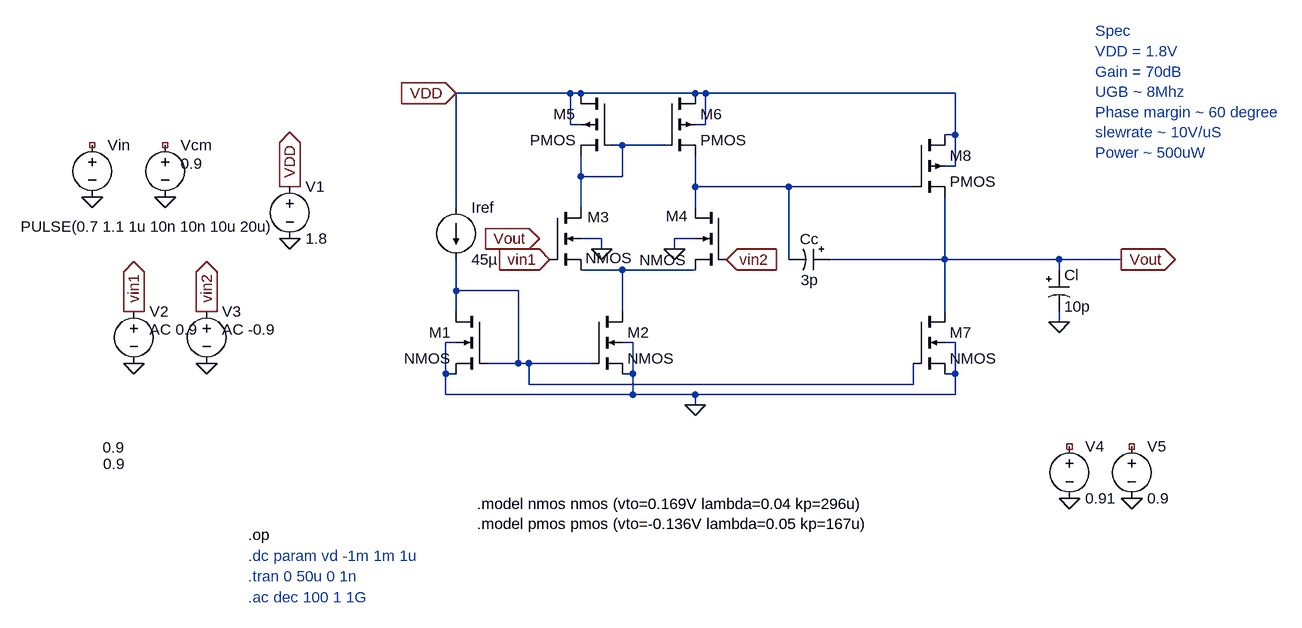
[diagram p0: schematic opamp.asc]
opamp.asc, the LTspice schematic file:
Version 4
SHEET 1 1312 776
WIRE 192 -48 16 -48
WIRE 208 -48 192 -48
WIRE 384 -48 208 -48
WIRE 400 -48 384 -48
WIRE 784 -48 400 -48
WIRE 192 0 192 -48
WIRE 208 0 192 0
WIRE 400 0 400 -48
WIRE 400 0 384 0
WIRE 784 16 784 -48
WIRE 784 16 768 16
WIRE 272 32 256 32
WIRE 336 32 272 32
WIRE 784 64 784 16
WIRE 784 64 768 64
WIRE 208 80 208 48
WIRE 272 80 272 32
WIRE 272 80 208 80
WIRE 384 96 384 48
WIRE 528 96 384 96
WIRE 720 96 528 96
WIRE 16 128 16 -48
WIRE 208 128 208 80
WIRE 384 128 384 96
WIRE 240 176 208 176
WIRE 384 176 352 176
WIRE 240 192 240 176
WIRE 352 192 352 176
WIRE 528 208 528 96
WIRE 768 208 768 112
WIRE 768 208 592 208
WIRE 944 208 768 208
WIRE 1040 208 944 208
WIRE 272 224 208 224
WIRE 384 224 272 224
WIRE 944 224 944 208
WIRE 16 256 16 208
WIRE 112 256 16 256
WIRE 16 288 16 256
WIRE 272 288 272 224
WIRE 768 288 768 208
WIRE 944 304 944 288
WIRE 16 336 0 336
WIRE 288 336 272 336
WIRE 784 336 768 336
WIRE 112 368 112 256
WIRE 112 368 64 368
WIRE 128 368 112 368
WIRE 224 368 128 368
WIRE 0 384 0 336
WIRE 16 384 0 384
WIRE 288 384 288 336
WIRE 288 384 272 384
WIRE 784 384 784 336
WIRE 784 384 768 384
WIRE 128 400 128 368
WIRE 720 400 720 368
WIRE 720 400 128 400
WIRE 0 416 0 384
WIRE 288 416 288 384
WIRE 288 416 0 416
WIRE 384 416 288 416
WIRE 784 416 784 384
WIRE 784 416 384 416
WIRE 384 432 384 416
FLAG 1040 208 Vout
IOPIN 1040 208 Out
FLAG 16 -48 VDD
IOPIN 16 -48 In
FLAG 384 432 0
FLAG 944 304 0
FLAG 160 208 vin1
IOPIN 160 208 In
FLAG 432 208 vin2
IOPIN 432 208 In
FLAG -240 96 VDD
IOPIN -240 96 Out
FLAG -240 176 0
FLAG -480 368 0
FLAG -368 368 0
FLAG -480 288 vin1
IOPIN -480 288 Out
FLAG -368 288 vin2
IOPIN -368 288 Out
FLAG 144 176 Vout
IOPIN 144 176 In
FLAG 240 192 0
FLAG 352 192 0
FLAG -544 112 0
FLAG -432 112 0
FLAG 960 576 0
FLAG 1056 576 0
SYMBOL nmos4 64 288 M0
SYMATTR InstName M1
SYMATTR Value2 l=1u w=5.07u
SYMBOL nmos4 224 288 R0
SYMATTR InstName M2
SYMATTR Value2 l=1u w=5.07u
SYMBOL current 16 128 R0
WINDOW 123 0 0 Left 0
WINDOW 39 0 0 Left 0
SYMATTR InstName Iref
SYMATTR Value 45µ
SYMBOL nmos4 160 128 R0
WINDOW 0 58 15 Left 2
WINDOW 3 55 78 Left 2
SYMATTR InstName M3
SYMATTR Value2 l=1u w=0.9u
SYMBOL nmos4 432 128 M0
WINDOW 0 59 13 Left 2
WINDOW 3 62 81 Left 2
SYMATTR InstName M4
SYMATTR Value2 l=1u w=0.9u
SYMBOL pmos4 256 -48 M0
SYMATTR InstName M5
SYMATTR Value2 l=1u w=4.49u
SYMBOL pmos4 336 -48 R0
SYMATTR InstName M6
SYMATTR Value2 l=1u w=4.49u
SYMBOL nmos4 720 288 R0
SYMATTR InstName M7
SYMATTR Value2 l=1u w=18u
SYMBOL polcap 592 192 R90
WINDOW 0 0 32 VBottom 2
WINDOW 3 32 32 VTop 2
SYMATTR InstName Cc
SYMATTR Value 3p
SYMBOL pmos4 720 16 R0
SYMATTR InstName M8
SYMATTR Value2 l=1u w=31u
SYMBOL polcap 928 224 R0
SYMATTR InstName Cl
SYMATTR Value 10p
SYMBOL voltage -240 80 R0
WINDOW 123 0 0 Left 0
WINDOW 39 0 0 Left 0
SYMATTR InstName V1
SYMATTR Value 1.8
SYMBOL voltage -480 272 R0
WINDOW 3 -48 225 Left 2
WINDOW 123 24 44 Left 2
WINDOW 39 0 0 Left 0
SYMATTR Value 0.9
SYMATTR Value2 AC 0.9
SYMATTR InstName V2
SYMBOL voltage -368 272 R0
WINDOW 3 -159 251 Left 2
WINDOW 123 24 44 Left 2
WINDOW 39 0 0 Left 0
SYMATTR Value 0.9
SYMATTR Value2 AC -0.9
SYMATTR InstName V3
SYMBOL voltage -544 16 R0
WINDOW 3 -110 141 Left 2
WINDOW 123 0 0 Left 0
WINDOW 39 0 0 Left 0
SYMATTR Value PULSE(0.7 1.1 1u 10n 10n 10u 20u)
SYMATTR InstName Vin
SYMBOL voltage -432 16 R0
WINDOW 3 24 44 Left 2
WINDOW 123 0 0 Left 0
WINDOW 39 0 0 Left 0
SYMATTR Value 0.9
SYMATTR InstName Vcm
SYMBOL voltage 960 480 R0
WINDOW 123 0 0 Left 0
WINDOW 39 0 0 Left 0
SYMATTR InstName V4
SYMATTR Value 0.91
SYMBOL voltage 1056 480 R0
WINDOW 123 0 0 Left 0
WINDOW 39 0 0 Left 0
SYMATTR InstName V5
SYMATTR Value 0.9
TEXT 48 584 Left 2 !.model nmos nmos (vto=0.169V lambda=0.04 kp=296u)\n.model pmos pmos (vto=-0.136V lambda=0.05 kp=167u)
TEXT -304 632 Left 2 !.op
TEXT 1000 -144 Left 2 ;Spec\nVDD = 1.8V\nGain = 70dB\nUGB ~ 8Mhz\nPhase margin ~ 60 degree\nslewrate ~ 10V/uS\nPower ~ 500uW
TEXT -304 664 Left 2 ;.dc param vd -1m 1m 1u
TEXT -304 728 Left 2 ;.ac dec 100 1 1G
TEXT -304 696 Left 2 ;.tran 0 50u 0 1n

The netlist it stands for:
* opamp.asc
M1 N004 N004 0 0 NMOS l=1u w=5.07u
M2 N003 N004 0 0 NMOS l=1u w=5.07u
Iref VDD N004 45µ
M3 N001 vin1 N003 0 NMOS l=1u w=0.9u
M4 N002 vin2 N003 0 NMOS l=1u w=0.9u
M5 VDD N001 N001 VDD PMOS l=1u w=4.49u
M6 VDD N001 N002 VDD PMOS l=1u w=4.49u
M7 Vout N004 0 0 NMOS l=1u w=18u
Cc Vout N002 3p
M8 VDD N002 Vout VDD PMOS l=1u w=31u
Cl Vout 0 10p
V1 VDD 0 1.8
V2 vin1 0 0.9 AC 0.9
V3 vin2 0 0.9 AC -0.9
Vin NC_01 0 PULSE(0.7 1.1 1u 10n 10n 10u 20u)
Vcm NC_02 0 0.9
V4 NC_03 0 0.91
V5 NC_04 0 0.9
.model NMOS NMOS
.model PMOS PMOS
.lib standard.mos
.model nmos nmos (vto=0.169V lambda=0.04 kp=296u)
.model pmos pmos (vto=-0.136V lambda=0.05 kp=167u)
.op
* Spec
* VDD = 1.8V
* Gain = 70dB
* UGB ~ 8Mhz
* Phase margin ~ 60 degree
* slewrate ~ 10V/uS
* Power ~ 500uW
* .dc param vd -1m 1m 1u
* .ac dec 100 1 1G
* .tran 0 50u 0 1n
.backanno
.end